# Altium schematic sheet LVDS.SchDoc
size A4; DocumentNumber: 2; SheetNumber: 2; SheetTotal: 7
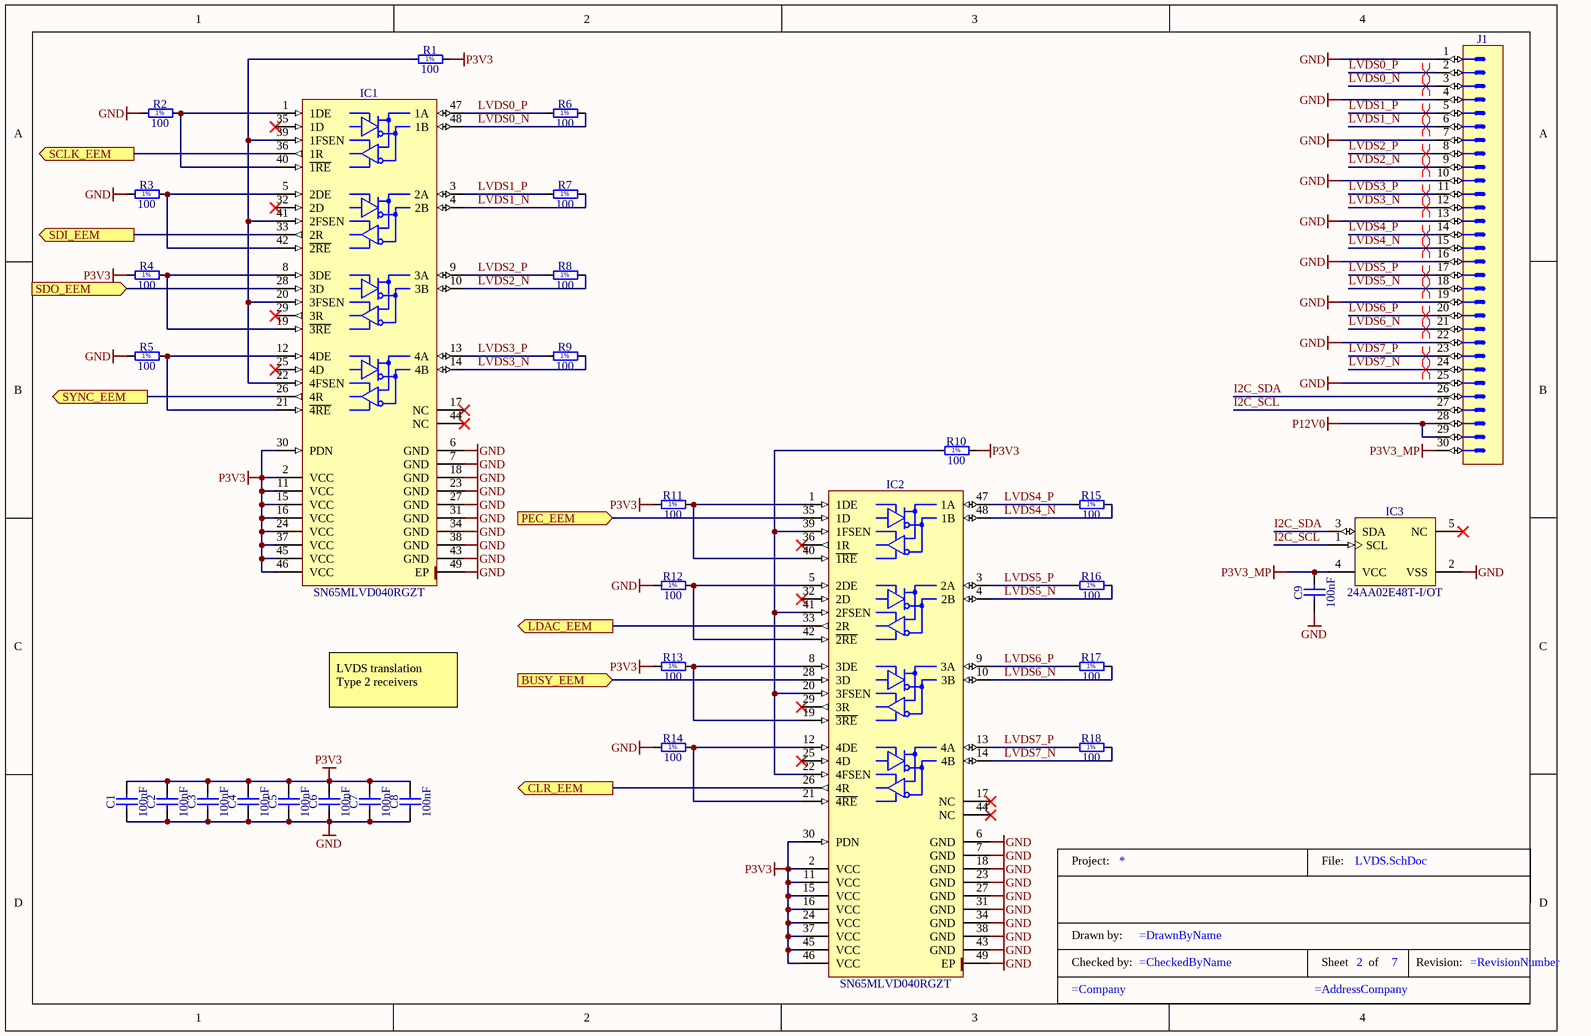
[diagram p0: LVDS.SchDoc]

## Parts
C1  100nF  [CAPC1005X55N]
C2  100nF  [CAPC1005X55N]
C3  100nF  [CAPC1005X55N]
C4  100nF  [CAPC1005X55N]
C5  100nF  [CAPC1005X55N]
C6  100nF  [CAPC1005X55N]
C7  100nF  [CAPC1005X55N]
C8  100nF  [CAPC1005X55N]
C9  100nF  [CAPC1005X55N]
IC1  SN65MLVD040RGZT  [QFN50P700X700X100-49N-S420]
IC2  SN65MLVD040RGZT  [QFN50P700X700X100-49N-S420]
IC3  24AA02E48T-I/OT  [SOT95P280X145-5N]
J1  Header 30  [3M_N2530-6002RB]  (value not drawn)
R1  100  [RESC1005X40N]
R2  100  [RESC1005X40N]
R3  100  [RESC1005X40N]
R4  100  [RESC1005X40N]
R5  100  [RESC1005X40N]
R6  100  [RESC1005X40N]
R7  100  [RESC1005X40N]
R8  100  [RESC1005X40N]
R9  100  [RESC1005X40N]
R10  100  [RESC1005X40N]
R11  100  [RESC1005X40N]
R12  100  [RESC1005X40N]
R13  100  [RESC1005X40N]
R14  100  [RESC1005X40N]
R15  100  [RESC1005X40N]
R16  100  [RESC1005X40N]
R17  100  [RESC1005X40N]
R18  100  [RESC1005X40N]
TitleBlock2  TitleBlock  (value not drawn)  (graphical)

## Ports
BUSY_EEM (in), CLR_EEM (out), LDAC_EEM (out), PEC_EEM (in), SCLK_EEM (out), SDI_EEM (out), SDO_EEM (in), SYNC_EEM (out)

## Nets
GND: C1.1 C2.1 C3.1 C4.1 C5.1 C6.1 C7.1 C8.1 C9.1 IC1.6(GND) IC1.7(GND) IC1.18(GND) IC1.23(GND) IC1.27(GND) IC1.31(GND) IC1.34(GND) IC1.38(GND) IC1.43(GND) IC1.49(EP) IC2.6(GND) IC2.7(GND) IC2.18(GND) IC2.23(GND) IC2.27(GND) IC2.31(GND) IC2.34(GND) IC2.38(GND) IC2.43(GND) IC2.49(EP) IC3.2(VSS) J1.1 J1.4 J1.7 J1.10 J1.13 J1.16 J1.19 J1.22 J1.25 R2.1 R3.1 R5.1 R12.1 R14.1
P3V3: C1.2 C2.2 C3.2 C4.2 C5.2 C6.2 C7.2 C8.2 IC1.2(VCC) IC1.11(VCC) IC1.15(VCC) IC1.16(VCC) IC1.24(VCC) IC1.30(PDN) IC1.37(VCC) IC1.45(VCC) IC1.46(VCC) IC2.2(VCC) IC2.11(VCC) IC2.15(VCC) IC2.16(VCC) IC2.24(VCC) IC2.30(PDN) IC2.37(VCC) IC2.45(VCC) IC2.46(VCC) R1.2 R4.1 R10.2 R11.1 R13.1
P3V3_MP: C9.2 IC3.4(VCC) J1.30
P12V0: J1.28 J1.29
BUSY_EEM: IC2.28(3D) ; port BUSY_EEM
CLR_EEM: IC2.26(4R) ; port CLR_EEM
I2C_SCL: IC3.1(SCL) J1.27
I2C_SDA: IC3.3(SDA) J1.26
LDAC_EEM: IC2.33(2R) ; port LDAC_EEM
LVDS0_N: IC1.48(1B) J1.3 R6.2
LVDS0_P: IC1.47(1A) J1.2 R6.1
LVDS1_N: IC1.4(2B) J1.6 R7.2
LVDS1_P: IC1.3(2A) J1.5 R7.1
LVDS2_N: IC1.10(3B) J1.9 R8.2
LVDS2_P: IC1.9(3A) J1.8 R8.1
LVDS3_N: IC1.14(4B) J1.12 R9.2
LVDS3_P: IC1.13(4A) J1.11 R9.1
LVDS4_N: IC2.48(1B) J1.15 R15.2
LVDS4_P: IC2.47(1A) J1.14 R15.1
LVDS5_N: IC2.4(2B) J1.18 R16.2
LVDS5_P: IC2.3(2A) J1.17 R16.1
LVDS6_N: IC2.10(3B) J1.21 R17.2
LVDS6_P: IC2.9(3A) J1.20 R17.1
LVDS7_N: IC2.14(4B) J1.24 R18.2
LVDS7_P: IC2.13(4A) J1.23 R18.1
PEC_EEM: IC2.35(1D) ; port PEC_EEM
SCLK_EEM: IC1.36(1R) ; port SCLK_EEM
SDI_EEM: IC1.33(2R) ; port SDI_EEM
SDO_EEM: IC1.28(3D) ; port SDO_EEM
SYNC_EEM: IC1.26(4R) ; port SYNC_EEM
NetIC1_1: IC1.1(1DE) IC1.40(~{1RE}) R2.2
NetIC1_5: IC1.5(2DE) IC1.42(~{2RE}) R3.2
NetIC1_8: IC1.8(3DE) IC1.19(~{3RE}) R4.2
NetIC1_12: IC1.12(4DE) IC1.21(~{4RE}) R5.2
NetIC1_20: IC1.20(3FSEN) IC1.22(4FSEN) IC1.39(1FSEN) IC1.41(2FSEN) R1.1
NetIC2_1: IC2.1(1DE) IC2.40(~{1RE}) R11.2
NetIC2_5: IC2.5(2DE) IC2.42(~{2RE}) R12.2
NetIC2_8: IC2.8(3DE) IC2.19(~{3RE}) R13.2
NetIC2_12: IC2.12(4DE) IC2.21(~{4RE}) R14.2
NetIC2_20: IC2.20(3FSEN) IC2.22(4FSEN) IC2.39(1FSEN) IC2.41(2FSEN) R10.1

Not connected (* = marked no-connect by the designer): IC1 17(NC)* 25(4D)* 29(3R)* 32(2D)* 35(1D)* 44(NC)*; IC2 17(NC)* 25(4D)* 29(3R)* 32(2D)* 36(1R)* 44(NC)*; IC3 5(NC)*

## Layout directives
differential pair: LVDS0_N, LVDS0_P, LVDS1_N, LVDS1_P, LVDS2_N, LVDS2_P, LVDS3_N, LVDS3_P, LVDS4_N, LVDS4_P, LVDS5_N, LVDS5_P, LVDS6_N, LVDS6_P, LVDS7_N, LVDS7_P

## Notes on the sheet
- LVDS translation    Type 2 receivers
- (in symbol R0402_100R_1%_0.1W_100PPM) 1%
- (in symbol TitleBlock) Project:; File:; Drawn by:; Checked by:; Sheet; of; Revision:

## Library data of the parts
C1-C9 = CC0402_100NF_16V_10%_X7R: Non-polarised capacitor; Part Description: SMD Multilayer Chip Ceramic Capacitor; Manufacturer: GENERIC; Manufacturer1 Part Number: GRM155R71C104KA88D; Voltage: 16V; TC: X7R; Tolerance: ±10%; Part Number: CC0402_100NF_16V_10%_X7R; Component Kind: Standard; Component Type: Standard; Pin Count: 2; Value: 100nF; Status: Not Recommended; Manufacturer Part Number: CC0402_100NF_16V_10%_X7R; Case: 0402; Mounted: Yes; Socket: No; SMD: Yes; Sense: No; Manufacturer1 Example: MURATA; Manufacturer1 ComponentHeight: 0.55mm; HelpURL: \\cern.ch\dfs\Applications\Altium\Datasheets\CC0402_X7R_MURATA_GRM.pdf; Author: CERN DEM JLC; CreateDate: 05.12.2013; LatestRevisionDate: 03.12.2007
IC1 IC2 = SN65MLVD040RGZT: 4-Channel Half-Duplex M-LVDS Line Transceiver; Manufacturer: TEXAS INSTRUMENTS; PressFit: No; Bonding: No; Part Number: SN65MLVD040RGZT; Component Kind: Standard; Component Type: Standard; Device: SN65MLVD040RGZT; PackageDescription: QFN, 0.50mm Pitch, Square; 48 Pin, 7.00mm L X 7.00mm W X 1.00mm H body (w/Thermal Tab 4.20 X 4.20mm), IPC Medium Density; Part Description: 4-Channel Half-Duplex M-LVDS Line Transceiver; Manufacturer Part Number: SN65MLVD040RGZT; Pin Count: 49; Case: QFN48; Mounted: Yes; Socket: No; SMD: Yes; Sense: No; ComponentHeight: 1mm; Author: CERN DEM JLC; HelpURL: \\cern.ch\dfs\Applications\Altium\Datasheets\SN65MLVD040RGZT.pdf; CreateDate: 17.03.2011; LatestRevisionDate: 17.03.2011
IC3 = 24AA02E48T-I/OT: 1.7V-5.5V, 2K I2C Serial EEPROM With EUI-48 Node Identity; Manufacturer: MICROCHIP TECHNOLOGY; PressFit: No; Bonding: No; Part Number: 24AA02E48T-I/OT; Component Kind: Standard; Component Type: Standard; Device: 24AA02E48T-I/OT; PackageDescription: SOT, 0.95mm pitch; 5 pin, 1.60mm W X 2.90mm L X 1.45mm H body, IPC Medium Density; Part Description: 1.7V-5.5V, 2K I2C Serial EEPROM With EUI-48 Node Identity; Manufacturer Part Number: 24AA02E48T-I/OT; Pin Count: 5; Case: SOT23-5; Mounted: Yes; Socket: No; SMD: Yes; Sense: No; ComponentHeight: 1.45mm; HelpURL: \\cern.ch\dfs\Applications\Altium\Datasheets\24AA02E48T-I-OT.pdf; Author: CERN DEM MR; CreateDate: 31.03.2016; LatestRevisionDate: 31.03.2016
J1 = 3M_N2530-6002RB: Connector 30 Male; Part Description: 30 Contacts - Straight .100'' x .100'' Low Profile Four-Wall Header, 2500 Series; Manufacturer: 3M; PressFit: No; Part Number: 3M_N2530-6002RB; Component Kind: Standard; Component Type: Standard; Pin Count: 30; Family: Header 30; Mounted: Yes; Socket: No; SMD: No; Sense: No; Status: None; Manufacturer Part Number: N2530-6002RB; ComponentHeight: 10.03mm; HelpURL: \\cern.ch\dfs\Applications\Altium\Datasheets\3M_N2530-6002RB.pdf; Author: CERN DEM JLC; CreateDate: 11.02.2009; LatestRevisionDate: 11.08.2009
R1-R18 = R0402_100R_1%_0.1W_100PPM: Resistor - 1%; Part Description: General Purpose Thick Film Chip Resistor; Manufacturer: GENERIC; Manufacturer Part Number: R0402_100R_1%_0.1W_100PPM_50V; Manufacturer1 Part Number: ERJ2RKF1000X; Power: 0.1W; TC: ±100ppm/°C; Voltage: 50V; PressFit: No; Part Number: R0402_100R_1%_0.1W_100PPM; Component Kind: Standard; Component Type: Standard; Pin Count: 2; Value: 100; Status: Not Recommended; Tolerance: ±1%; Case: 0402; Mounted: Yes; Sense: No; Socket: No; SMD: Yes; Manufacturer1 Example: PANASONIC; Manufacturer1 ComponentHeight: 0.4mm; HelpURL: \\cern.ch\dfs\Applications\Altium\Datasheets\R0402_PANASONIC_ERJ2RK.pdf; Author: CERN DEM JLC; CreateDate: 12.12.2013; LatestRevisionDate: 03.03.2015